# EAGLE schematic pcb_3.0 (EAGLE 8.6.1)
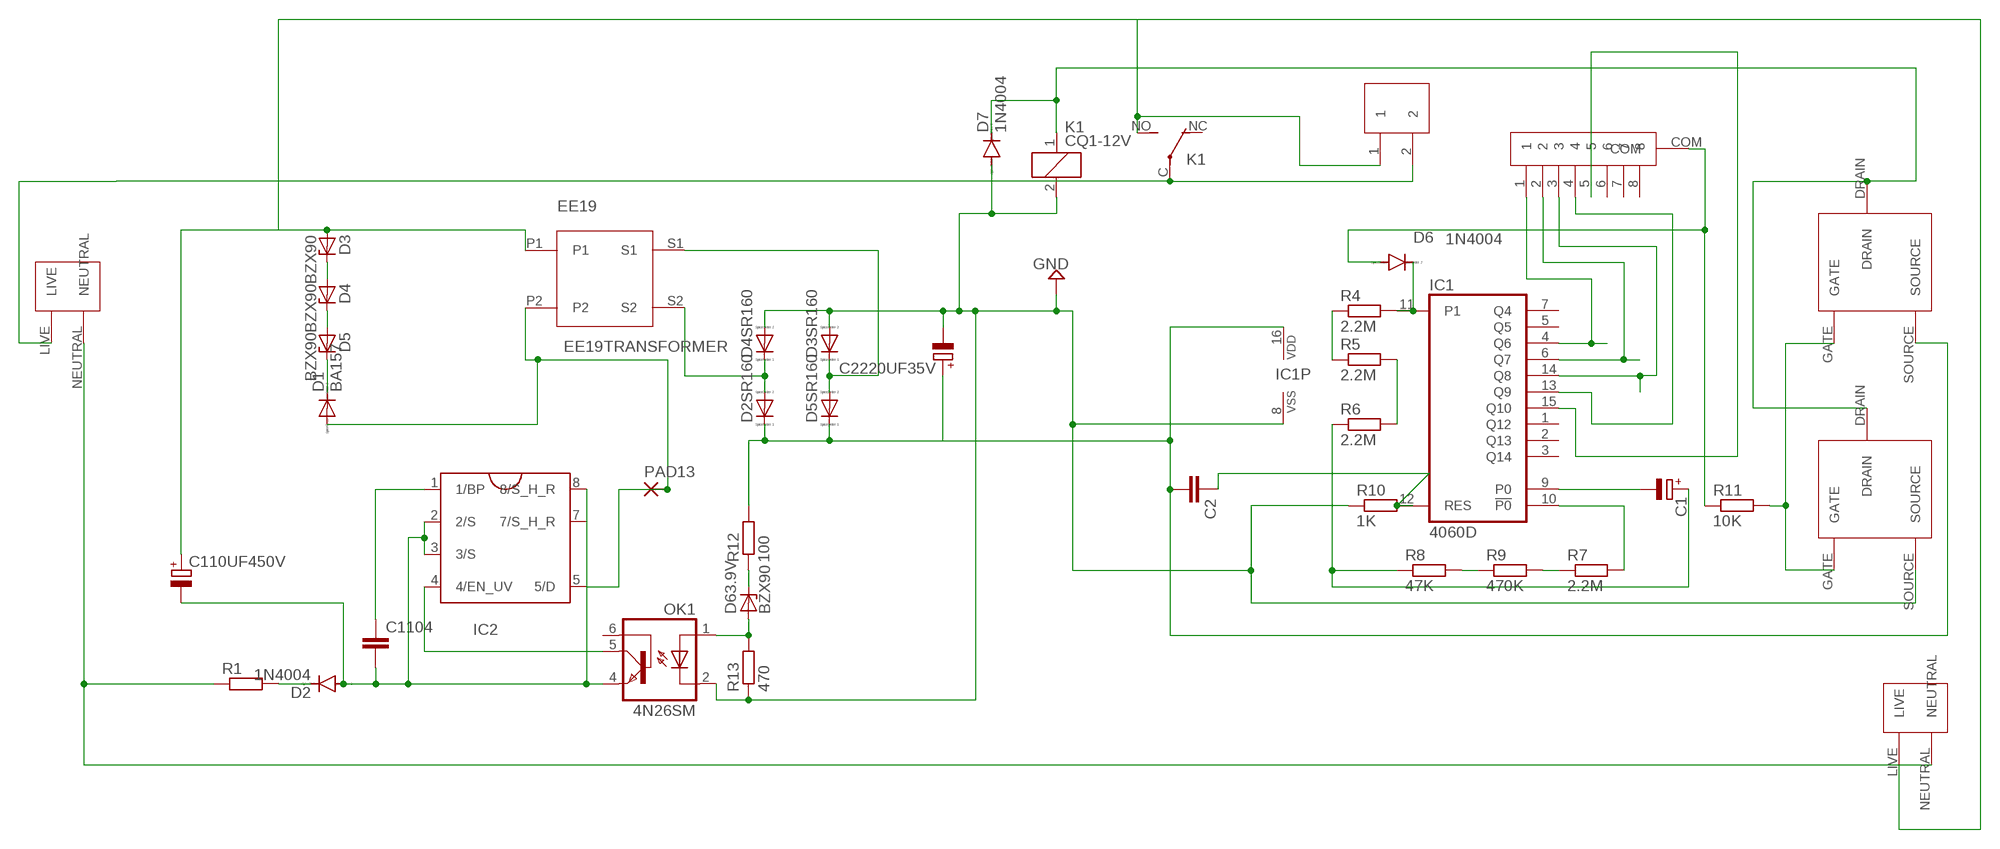
[diagram p0: schematic, sheet 1]

## Parts
C1  CPOL-EUE2.5-6  [E2,5-6]
C2  C-EU025-025X050  [C025-025X050]
C110UF450V  CPOL-EUE5-10.5  [E5-10,5]
C1104  C-EU025-024X044  [C025-024X044]
C2220UF35V  CPOL-EUE3.5-8  [E3,5-8]
D1  BA157  [P1-10]
D2  1N4004  [DO41-10]
D2SR160  DIODE_E-DO35-7  [DIODE_DO35-7]
D3  BZX90  [DO34Z7]
D3SR160  DIODE_E-DO35-7  [DIODE_DO35-7]
D4  BZX90  [DO34Z7]
D4SR160  DIODE_E-DO35-7  [DIODE_DO35-7]
D5  BZX90  [DO34Z7]
D5SR160  DIODE_E-DO35-7  [DIODE_DO35-7]
D6  1N4004  [DO41-10]
D7  1N4004  [DO41-10]
D63.9V  BZX90  [DO34Z7]
IC1  4060D  [SO16]
IC2  TNY263-268  [DIP8B_SMD(G_PACKAGE)]
K1  CQ1-12V  [CQ1]
OK1  4N26SM  [DIL6-SMD]
PAD13  2,15/1,0  [2,15/1,0]
R1  R-EU_0207/10  [0207/10]
R4  2.2M  R-EU_0204/5  [0204/5]
R5  2.2M  R-EU_0204/5  [0204/5]
R6  2.2M  R-EU_0204/5  [0204/5]
R7  2.2M  R-EU_0204/5  [0204/5]
R8  47K  R-EU_0204/5  [0204/5]
R9  470K  R-EU_0204/5  [0204/5]
R10  1K  R-EU_0204/5  [0204/5]
R11  10K  R-EU_0204/5  [0204/5]
R12  100  R-EU_0204/5  [0204/5]
R13  470  R-EU_0204/5  [0204/5]
U$1  EE19TRANSFORMER  [EE19]
U$2  FR9024N  [FR9024N]
U$3  FR9024N  [FR9024N]
U$4  AC_INPUT  [AC_INPUT]
U$5  AC_INPUT  [AC_INPUT]
U$6  AC_PUSH_BUTTON  [AC_PUSH_BUTTON]
U$7  SINGLE_POLE_5_TRS  [SINGLE_POLE_8_TRS]

## Nets
GND: C2220UF35V.- D3SR160.A(C) D4SR160.A(C) D7.A IC1.8(VSS) K1.2 OK1.2(C) R10.1 R13.1 U$2.SOURCE
N$1: D3.C D4.A
N$2: D2.C R1.2
N$3: IC1.4(Q6) U$7.1
N$4: D63.9V.A OK1.1(A) R13.2
N$5: D1.A IC2.5(5/D) PAD13.1(P) U$1.P2
N$6: D63.9V.C R12.1
N$7: D2SR160.A(C) D4SR160.C(A) U$1.S2
N$8: C2.2 C2220UF35V.+ D2SR160.C(A) D5SR160.C(A) IC1.16(VDD) R12.2 U$3.SOURCE
N$9: R11.2 U$2.GATE U$3.GATE
N$10: D3SR160.C(A) D5SR160.A(C) U$1.S1
N$11: IC2.4(4/EN_UV) OK1.5(COL)
N$12: C1104.1 IC2.1(1/BP)
N$13: C110UF450V.- C1104.2 D2.A IC2.2(2/S) IC2.3(3/S) IC2.7(7/S_H_R) IC2.8(8/S_H_R) OK1.4(EMI)
N$14: D6.C IC1.11(P1) R4.2
N$15: D4.C D5.A
N$16: D1.C D5.C
N$17: R4.1 R5.1
N$18: R5.2 R6.2
N$19: IC1.10(!P0) R7.2
N$20: R7.1 R9.2
N$21: R8.2 R9.1
N$22: C1.+ R6.1 R8.1
N$23: IC1.6(Q7) U$7.2
N$24: IC1.14(Q8) U$7.3
N$25: IC1.13(Q9) U$7.4
N$26: IC1.15(Q10) U$7.5
N$27: D6.A R11.1 U$7.COM
N$29: D7.C K1.1 U$2.DRAIN U$3.DRAIN
N$30: C110UF450V.+ D3.A K1.NO(2:S) U$1.P1 U$5.LIVE U$6.1
N$33: C1.- IC1.9(P0)
N$34: C2.1 IC1.12(RES) R10.2
N$35: K1.C(2:P) U$4.LIVE U$6.2
N$36: R1.1 U$4.NEUTRAL U$5.NEUTRAL
Unconnected: IC1.1(Q12) IC1.2(Q13) IC1.3(Q14) IC1.5(Q5) IC1.7(Q4) K1.NC(2:O) OK1.6(BAS) U$7.6 U$7.7 U$7.8

## Library data of the parts
C1 C110UF450V C2220UF35V = rcl:CPOL-EU: POLARIZED CAPACITOR, European symbol; SPICEPREFIX: C
C2 C1104 = rcl:C-EU: CAPACITOR, European symbol; SPICEPREFIX: C
D1 = diode:BA157: DIODE fast soft-recovery controlled avalanche rectifier
D2 D6 D7 = diode:1N4004: DIODE general purpose rectifier, 1 A
D2SR160 D3SR160 D4SR160 D5SR160 = eagle-ltspice:DIODE_E-: Schottky Diode; SPICEMODEL: diode; SPICEPREFIX: D
D3-D5 D63.9V = diode:BZX90: Z DIODE
IC1 = 40xx:4060: 14-stage binary/ripple COUNTER; SPICEPREFIX: X
IC2 = power_integrations:TNY263-268: TinySwitch-II integrates a 700 V power MOSFET, oscillator, high voltage switched current source, current limit and thermal shutdown circuitry onto a monolithic device. The start-up and operating power are derived directly from the voltage on the DRAIN pin, eliminating the need for a bias winding and associated circuitry. In addition, the TinySwitch-II devices incorporate auto-restart, line undervoltage sense, and frequency jittering. An innovative design minimizes audio frequency components in the simple ON/OFF control scheme to practically eliminate audible noise with standard taped/varnished transformer construction. The fully integrated auto-restart circuit safely limits output power during fault conditions such as output short circuit or open loop, reducing component count and secondary feedback circuitry cost. An optional line sense resistor externally programs a line undervoltage threshold, which eliminates power down glitches caused by the slow discharge of input storage capacitors present in applications such as standby supplies. The operating frequency of 132 kHz is jittered to signifi cantly reduce both the quasi-peak and average EMI, minimizing fi ltering cost.; SPICEPREFIX: X
K1 = relay:CQ1-12V: AUTOMOTIVE QUIET RELAY NAiS Source: http://www.mew-europe.com/.. en_ds_61208_0000.pdf; OC_FARNELL: unknown; OC_NEWARK: unknown
OK1 = optocoupler:4N*?M: General Purpose 6-Pin Phototransistor Optocouplers Source: http://www.fairchildsemi.com/ds/4N/4N35-M.pdf; MPN: 4N26SM; OC_FARNELL: 1683383; OC_NEWARK: 40P1118
PAD13 = wirepad:2,15/1,0: THROUGH-HOLE PAD
R1 = rcl:R-EU_: RESISTOR, European symbol; SPICEPREFIX: R
R4-R13 = resistor:R-EU_: RESISTOR, European symbol
U$1 = ee19Transformer:EE19TRANSFORMER
U$2 U$3 = FR9024N:FR9024N
U$4 U$5 = ac_input:AC_INPUT
U$6 = AC_Push_Button:AC_PUSH_BUTTON
U$7 = single_pole_5_trs:SINGLE_POLE_5_TRS